# Altium schematic sheet 1541 Interface for ZX-81.SchDoc
size 594 x 420 mm; ApprovedBy: .; CheckedBy: .; Author: DiWou; CompanyName: DL2DW; DrawnBy: DiWou; Engineer: .; Organization: DL2DW; DocumentNumber: 1; Revision: A; SheetNumber: 1; SheetTotal: 1; DrawnDate: 08.10.2020; EngrDate: .; ChkdDate: .; Title1: 1541 Interface for ZX-81; Title2: .; Title3: .; Desc1: Version 1.0; Desc2: .; ApprDate: .
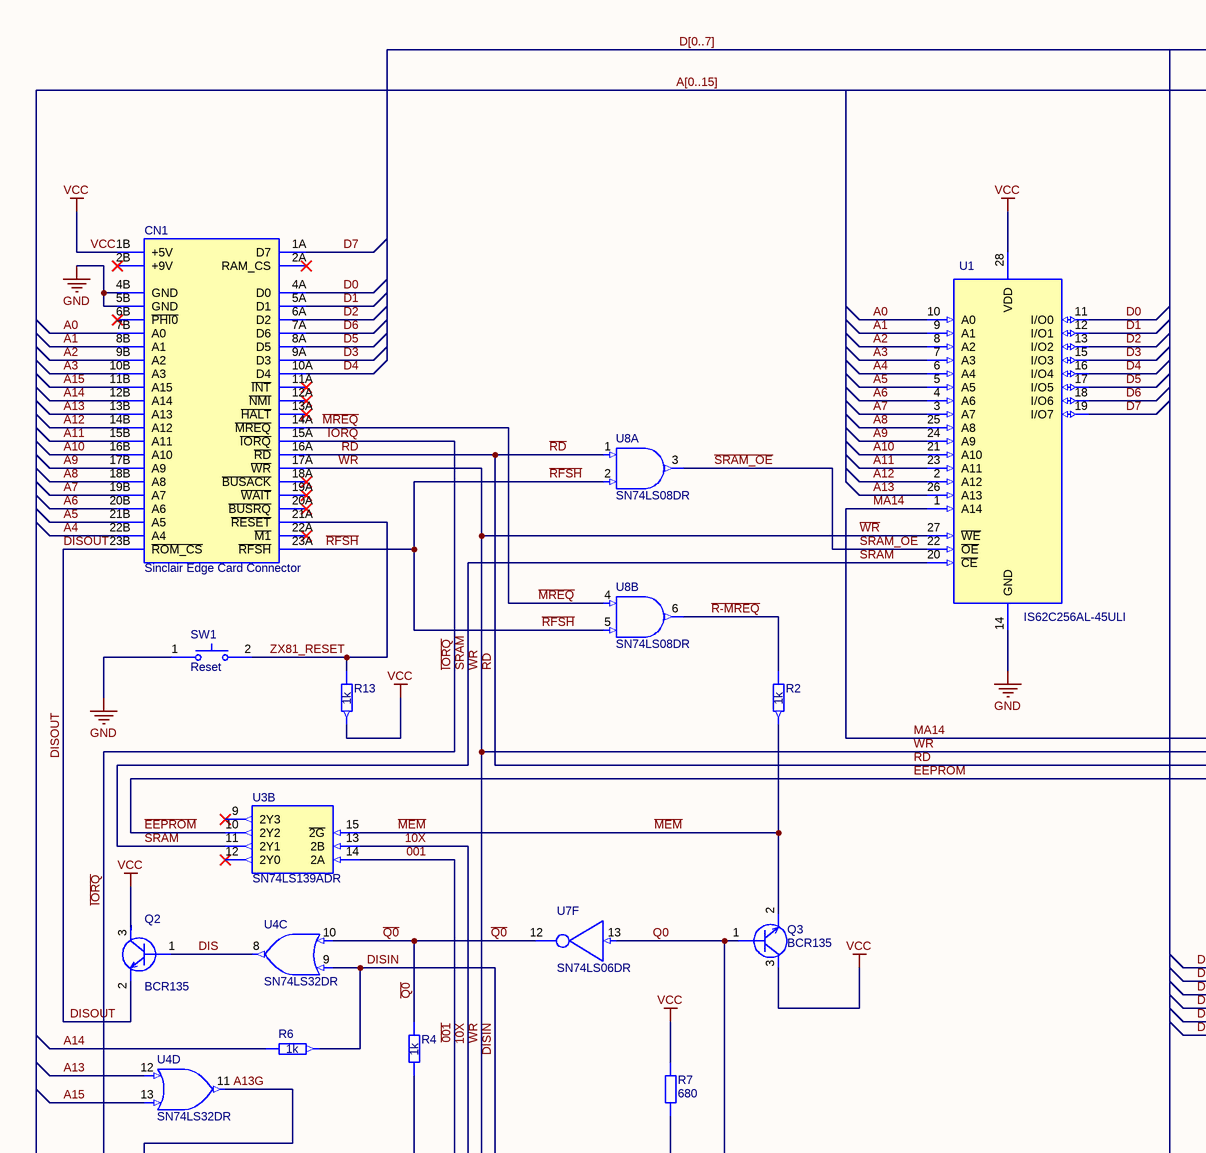
[diagram p0: 1541 Interface for ZX-81.SchDoc, top left]
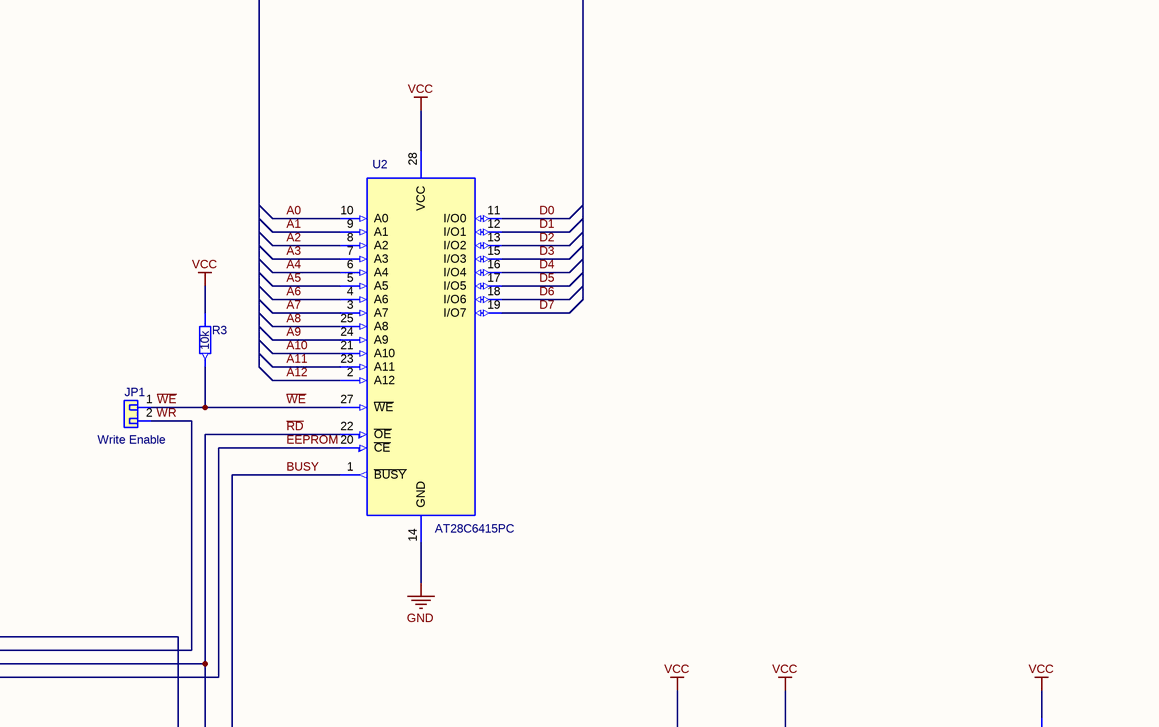
[diagram p1: 1541 Interface for ZX-81.SchDoc, top right]
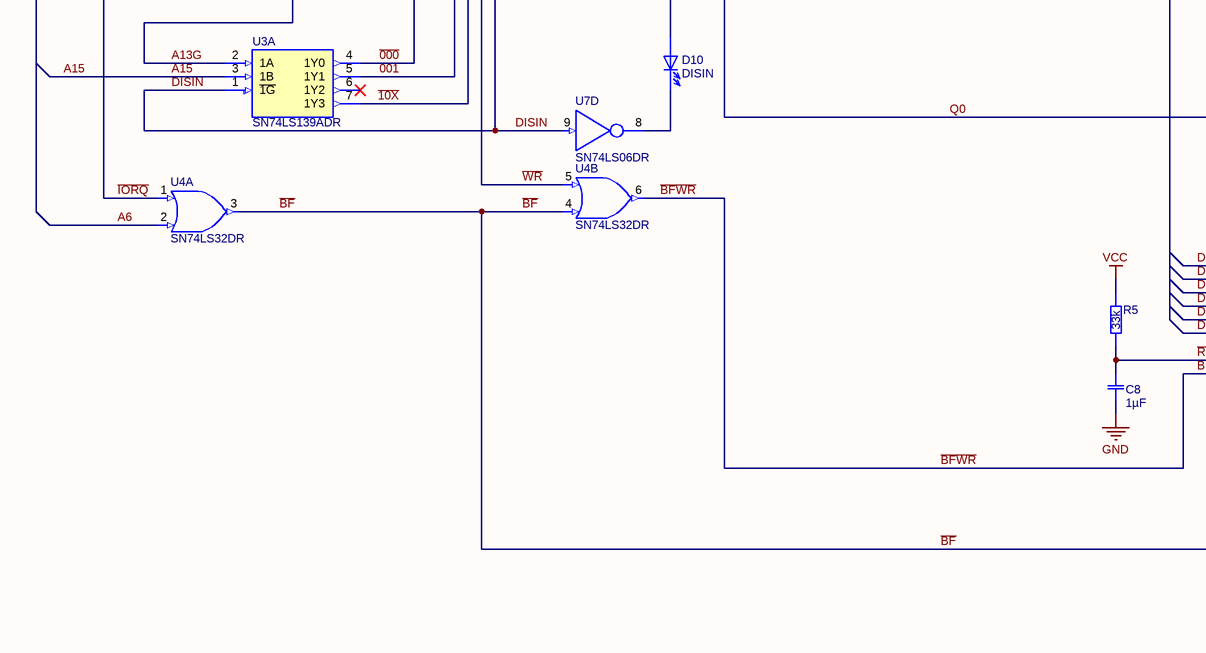
[diagram p2: 1541 Interface for ZX-81.SchDoc, bottom left]
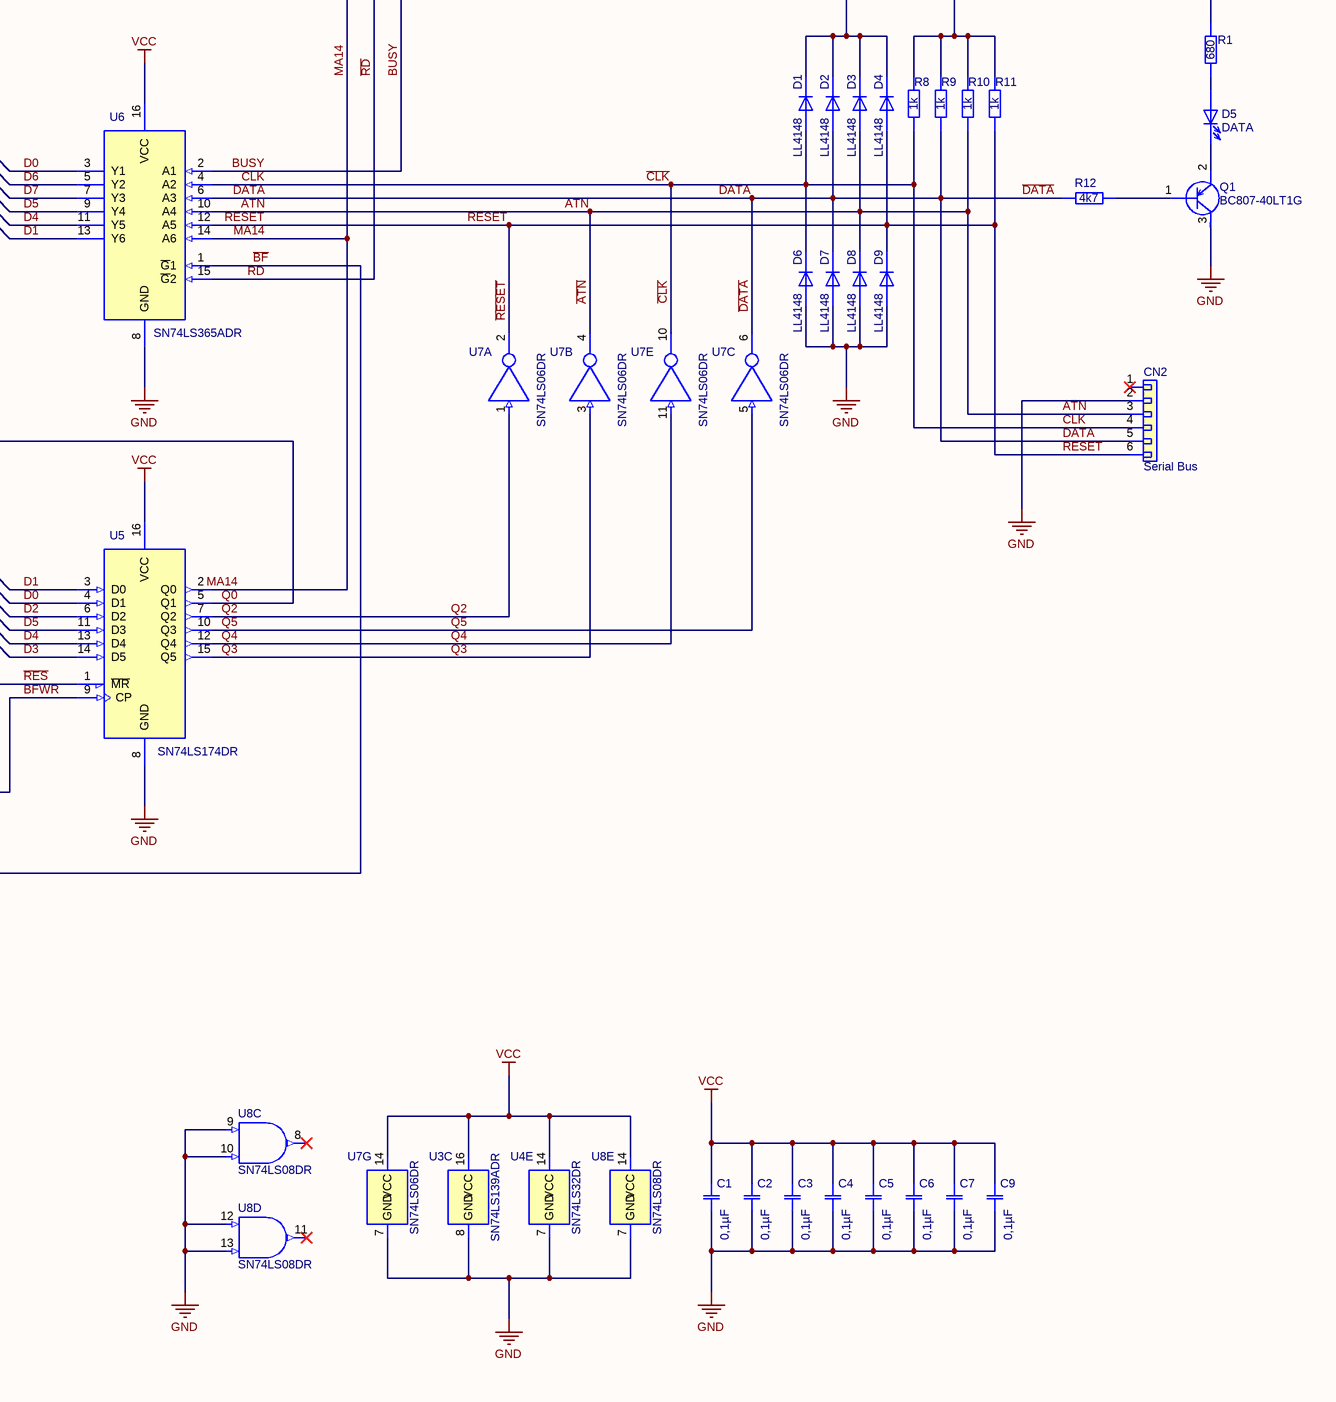
[diagram p3: 1541 Interface for ZX-81.SchDoc, bottom right]

## Parts
C1  0,1µF  [CAP SMD 0.1µF 50V 0805 Kemet C0805C104M5RACTU]
C2  0,1µF  [CAP SMD 0.1µF 50V 0805 Kemet C0805C104M5RACTU]
C3  0,1µF  [CAP SMD 0.1µF 50V 0805 Kemet C0805C104M5RACTU]
C4  0,1µF  [CAP SMD 0.1µF 50V 0805 Kemet C0805C104M5RACTU]
C5  0,1µF  [CAP SMD 0.1µF 50V 0805 Kemet C0805C104M5RACTU]
C6  0,1µF  [CAP SMD 0.1µF 50V 0805 Kemet C0805C104M5RACTU]
C7  0,1µF  [CAP SMD 0.1µF 50V 0805 Kemet C0805C104M5RACTU]
C8  1µF  [CAP 1µF 16V 0805 Kemet C0805C105K4RACTU]
C9  0,1µF  [CAP SMD 0.1µF 50V 0805 Kemet C0805C104M5RACTU]
CN1  Sinclair Edge Card Connector  [Sinclair Card Connector]
CN2  Serial Bus  [Pin Header 01x06 Right Angle RM2.54mm L5.08mm]
D1  LL4148  [MiniMELF Diode]
D2  LL4148  [MiniMELF Diode]
D3  LL4148  [MiniMELF Diode]
D4  LL4148  [MiniMELF Diode]
D5  DATA  [LED 3mm Red Right Angle 4mm]
D6  LL4148  [MiniMELF Diode]
D7  LL4148  [MiniMELF Diode]
D8  LL4148  [MiniMELF Diode]
D9  LL4148  [MiniMELF Diode]
D10  DISIN  [LED 3mm Green Right Angle 4mm]
JP1  Write Enable  [Pin Header 01x02 2.54mm Horizontal Male]
Q1  BC807-40LT1G  [Nexperia BC807-40 SOT23]
Q2  BCR135  [BCR135 SOT23]
Q3  BCR135  [BCR135 SOT23]
R1  680  [680 kOhm R 0805 SMD]
R2  1k  [1,0 kOhm R 0805 SMD]
R3  10k  [10 kOhm R 0805 SMD]
R4  1k  [1,0 kOhm R 0805 SMD]
R5  33k  [33 kOhm R 0805 SMD]
R6  1k  [1,0 kOhm R 0805 SMD]
R7  680  [680 kOhm R 0805 SMD]
R8  1k  [1,0 kOhm R 0805 SMD]
R9  1k  [1,0 kOhm R 0805 SMD]
R10  1k  [1,0 kOhm R 0805 SMD]
R11  1k  [1,0 kOhm R 0805 SMD]
R12  4k7  [4,7 kOhm R 0805 SMD]
R13  1k  [1,0 kOhm R 0805 SMD]
SW1  Reset  [Tactile Switch Push Button Right Angle L=8.35mm]
U1  IS62C256AL-45ULI  [IS62C256AL-45ULI 28L 330mil SOP]
U2  AT28C6415PC  [28C64-150 with Socket]
U3  SN74LS139ADR  [SN74LS139ADR SOIC-15 P1.27mm W3.9mm]  (parts A,B,C of 3)
U4  SN74LS32DR  [SN74LS32DR2 SOIC-14 P1.27mm W3.9mm]  (parts A,B,C,D,E of 5)
U5  SN74LS174DR  [SN74LS174DR SOIC-15 P1.27mm W3.9mm]
U6  SN74LS365ADR  [SN74LS365ADR SOIC-15 P1.27mm W3.9mm]
U7  SN74LS06DR  [SN74LS06DR SOIC-14 P1.27mm W3.9mm]  (parts A,B,C,D,E,F,G of 7)
U8  SN74LS08DR  [SN74LS08DR SOIC-14 P1.27mm W3.9mm]  (parts A,B,C,D,E of 5)

## Nets
GND: C1.1 C2.1 C3.1 C4.1 C5.1 C6.1 C7.1 C8.1 C9.1 CN1.4B(GND) CN1.5B(GND) CN2.2 D6.2 D7.2 D8.2 D9.2 Q1.3 SW1.1 U1.14(GND) U2.14(GND) U3.8(GND) U4.7(GND) U5.8(GND) U6.8(GND) U7.7(GND) U8.7(GND) U8.9(3A) U8.10(3B) U8.12(4A) U8.13(4B)
VCC: C1.2 C2.2 C3.2 C4.2 C5.2 C6.2 C7.2 C9.2 CN1.1B(+5V) D1.1 D2.1 D3.1 D4.1 Q2.3 Q3.3 R1.2 R3.1 R5.2 R7.2 R8.2 R9.2 R10.2 R11.2 R13.2 U1.28(VDD) U2.28(VCC) U3.16(VCC) U4.14(VCC) U5.16(VCC) U6.16(VCC) U7.14(VCC) U8.14(VCC)
~{000}: R4.1 U3.4(1Y0)
~{001}: U3.5(1Y1) U3.14(2A)
~{10X}: U3.7(1Y3) U3.13(2B)
A0: CN1.7B(A0) U1.10(A0) U2.10(A0)
A1: CN1.8B(A1) U1.9(A1) U2.9(A1)
A2: CN1.9B(A2) U1.8(A2) U2.8(A2)
A3: CN1.10B(A3) U1.7(A3) U2.7(A3)
A4: CN1.22B(A4) U1.6(A4) U2.6(A4)
A5: CN1.21B(A5) U1.5(A5) U2.5(A5)
A6: CN1.20B(A6) U1.4(A6) U2.4(A6) U4.2(1B)
A7: CN1.19B(A7) U1.3(A7) U2.3(A7)
A8: CN1.18B(A8) U1.25(A8) U2.25(A8)
A9: CN1.17B(A9) U1.24(A9) U2.24(A9)
A10: CN1.16B(A10) U1.21(A10) U2.21(A10)
A11: CN1.15B(A11) U1.23(A11) U2.23(A11)
A12: CN1.14B(A12) U1.2(A12) U2.2(A12)
A13: CN1.13B(A13) U1.26(A13) U4.12(4A)
A13G: U3.2(1A) U4.11(4Y)
A14: CN1.12B(A14) R6.1
A15: CN1.11B(A15) U3.3(1B) U4.13(4B)
~{ATN}: CN2.3 D3.2 D8.1 R10.1 U6.10(A4) U7.4(2Y)
~{BF}: U4.3(1Y) U4.4(2A) U6.1(~{G}1)
~{BFWR}: U4.6(2Y) U5.9(CP)
BUSY: U2.1(~{BUSY}) U6.2(A1)
~{CLK}: CN2.4 D1.2 D6.1 R8.1 U6.4(A2) U7.10(5Y)
D0: CN1.4A(D0) U1.11(I/O0) U2.11(I/O0) U5.4(D1) U6.3(Y1)
D1: CN1.5A(D1) U1.12(I/O1) U2.12(I/O1) U5.3(D0) U6.13(Y6)
D2: CN1.6A(D2) U1.13(I/O2) U2.13(I/O2) U5.6(D2)
D3: CN1.9A(D3) U1.15(I/O3) U2.15(I/O3) U5.14(D5)
D4: CN1.10A(D4) U1.16(I/O4) U2.16(I/O4) U5.13(D4) U6.11(Y5)
D5: CN1.8A(D5) U1.17(I/O5) U2.17(I/O5) U5.11(D3) U6.9(Y4)
D6: CN1.7A(D6) U1.18(I/O6) U2.18(I/O6) U6.5(Y2)
D7: CN1.1A(D7) U1.19(I/O7) U2.19(I/O7) U6.7(Y3)
~{DATA}: CN2.5 D2.2 D7.1 R9.1 R12.1 U6.6(A3) U7.6(3Y)
DIS: Q2.1 U4.8(3Y)
DISIN: R6.2 U3.1(~{1G}) U4.9(3A) U7.9(4A)
DISOUT: CN1.23B(~{ROM_CS}) Q2.2
~{EEPROM}: U2.20(~{CE}) U3.10(2Y2)
~{IORQ}: CN1.15A(~{IORQ}) U4.1(1A)
~{MEM}: Q3.2 R2.2 U3.15(~{2G})
~{MREQ}: CN1.14A(~{MREQ}) U8.4(2A)
MA14: U1.1(A14) U5.2(Q0) U6.14(A6)
Q0: Q3.1 U5.5(Q1) U7.13(6A)
Q2: U5.7(Q2) U7.1(1A)
Q3: U5.15(Q5) U7.3(2A)
Q4: U5.12(Q4) U7.11(5A)
Q5: U5.10(Q3) U7.5(3A)
~{Q0}: R4.2 U4.10(3B) U7.12(6Y)
~{R-MREQ}: R2.1 U8.6(2Y)
~{RD}: CN1.16A(~{RD}) U2.22(~{OE}) U6.15(~{G}2) U8.1(1A)
~{RES}: C8.2 R5.1 U5.1(~{MR})
~{RESET}: CN2.6 D4.2 D9.1 R11.1 U6.12(A5) U7.2(1Y)
~{RFSH}: CN1.23A(~{RFSH}) U8.2(1B) U8.5(2B)
~{SRAM}: U1.20(~{CE}) U3.11(2Y1)
~{SRAM_OE}: U1.22(~{OE}) U8.3(1Y)
~{WE}: JP1.1 R3.2 U2.27(~{WE})
~{WR}: CN1.17A(~{WR}) JP1.2 U1.27(~{WE}) U4.5(2B)
ZX81_RESET: CN1.21A(~{RESET}) R13.1 SW1.2
NetD5_1: D5.1 Q1.2
NetD5_2: D5.2 R1.1
NetD10_1: D10.1 U7.8(4Y)
NetD10_2: D10.2 R7.1
NetQ1_1: Q1.1 R12.2

Not connected (* = marked no-connect by the designer): CN1 2A(RAM_CS)* 2B(+9V)* 6B(~{PHI0})* 11A(~{INT})* 12A(~{NMI})* 13A(~{HALT})* 18A(~{BUSACK})* 19A(~{WAIT})* 20A(~{BUSRQ})* 22A(~{M1})*; CN2 1*; SW1 3 4; U2 26(N/C); U3 6(1Y2)* 9(2Y3)* 12(2Y0)*; U8 8(3Y)* 11(4Y)*

## Buses and harness runs
bus A[0..15]
bus D[0..7]

## Notes on the sheet
- Drawn by:
- Date
- Size:
- A2
- Rev:
- Engr:
- Chkd:
- Appr:
- File:
- Document No:
- Print Date & Time:
- /
- Sheet
- of

## Library data of the parts
C1-C7 C9 = CMP-Capacitors-Ceramic_Capacitors-00028-1: Capacitor; Ceramic; Cap; .100uF; Tol 20%; SMT; Vol-Rtg 50V; X7R; Tape and Reel; Capacitance: 100nF; Depth: 1.25mm; Packaging: Tape and Reel; Min Operating Temperature: -55°C; Max Operating Temperature: 125°C; Dielectric: X7R; Radiation Hardening: No; Mount: Surface Mount; Case/Package: 0805; Dielectric Material: Ceramic; Height: 0.9mm; Voltage Rating (DC): 50V; Length: 2mm; Tolerance: 20%
C8 = CMP-Capacitors-Ceramic_Capacitors-00042-2: KEMET - C0805C105K4RACTU - SMD Multilayer Ceramic Capacitor, 1 µF, 16 V, 0805 [2012 Metric], ± 10%, X7R, C Series KEMET; Voltage: 16V; Capacitance: 1uF; Dissipation Factor: 5%; Number of Pins: 2; Dielectric: X7R; Width: 0.049inch; Voltage Rating (DC): 16V; Depth: 1.25mm; Dielectric Material: Ceramic; Mount: Surface Mount,PCB; Radiation Hardening: No; Max Operating Temperature: 125°C; Thickness: 0.039inch; Packaging: Tape and Reel; Contact Plating: Tin,Matte; Lead Pitch: 0.75mm; Height: 0.9mm; Termination: SMD/SMT; Case Code (Imperial): 0805; REACH SVHC: No SVHC; Case/Package: 0805; Case Code (Metric): 2012; Voltage Rating: 16V; Length: 2mm; Package Quantity: 1; Tolerance: 10%; Min Operating Temperature: -55°C
CN1 = CMP-Connectors-00027-6
CN2 = CMP-Connectors-Male_PIN_Headers-00025-2: CONN HEADER R/A 6POS 2.54MM; Pitch: 0.1inch; Connector Type: Male Pin; Number of Positions: 6; Color: Black; Termination: Solder; Contact Mating Length: 0.23inch; Contact Plating: Gold; Number of Rows: 1; Packaging: Bulk; Package Quantity: 1; Mount: Through Hole
D1-D4 D6-D9 = CMP-Diodes-00018-2: ON SEMICONDUCTOR - LL4148 - Small Signal Diode, Single, 100 V, 200 mA, 1 V, 4 ns, 2 A; Power Dissipation: 500mW; Max Forward Surge Current (Ifsm): 2A; Forward Voltage: 1V; Forward Current: 200mA; Voltage: 100V; Max Reverse Current: 25nA; Recovery Time: 4ns; Element Configuration: Single; Min Operating Temperature: -65°C; Max Operating Temperature: 175°C; Width: 1.5mm; Radiation Hardening: No; REACH SVHC: No SVHC; Length: 3.6mm; Max Reverse Voltage (DC): 100V; Reverse Voltage: 100V; Mount: Surface Mount; Height: 1.5mm; Contact Plating: Tin,Matte; Packaging: Tape and Reel; Lead Free: Lead Free; Max Surge Current: 2A; Average Rectified Current: 200mA; Weight: 0.01lb; Number of Pins: 2; Peak Non-Repetitive Surge Current: 2A; Max Repetitive Reverse Voltage (Vrrm): 100V; Reverse Recovery Time: 4ns; Package Quantity: 2500
D5 = CMP-LEDs-00000-4: WURTH ELEKTRONIK   151033RS03000   LED, 3MM,  RED, 2600MCD, 621NM; Test Current: 20mA; Lens Style: Clear,Circular,Round; Forward Voltage: 2V; Viewing Angle: 30°; Forward Current: 30mA; Packaging: Bulk; Color: Red; Package Quantity: 1; Mount: Through Hole; Luminous Intensity: 2600mcd; Wavelength: 621nm; Lens Size: 3mm; Dominant Wavelength: 621nm; Case/Package: Radial; Min Operating Temperature: -40°C; REACH SVHC: Unknown; Max Operating Temperature: 85°C; Height: 5.55mm
D10 = CMP-LEDs-00007-1: WURTH ELEKTRONIK - 151033GS03000 - LED, Green, T-1 (3mm), 530 nm, 3.2 V, 30 mA, 15 cd RoHS Compliant: Yes; Forward Voltage: 3.2V; Luminous Intensity: 15000mcd; Lens Style: Clear,Round,Circular; Wavelength: 530nm; Viewing Angle: 30°; Forward Current: 30mA; Test Current: 20mA; Mount: Through Hole; Package Quantity: 1; Case/Package: Radial; Max Operating Temperature: 85°C; Color: Green; REACH SVHC: Unknown; Height: 5.55mm; Lens Size: 3mm; Min Operating Temperature: -40°C; Packaging: Bulk; Dominant Wavelength: 530nm
JP1 = CMP-Connectors-Male_PIN_Headers-00001-4: CONN HEADER .100" SNGL STR 2POS; Pitch: 0.1inch; Connector Type: Male Pin; Number of Positions: 2; Package Quantity: 1; Packaging: Bulk; Mount: Through Hole; Contact Mating Length: 0.318inch; Termination: Solder; Contact Plating: Gold; Color: Black; Number of Rows: 1
Q1 = CMP-Transistors-00011-1: Silicon Transistor Plastic,  BC807-40LT1G; Max Collector Current: 500mA; Power Dissipation: 300mW; Collector Emitter Breakdown Voltage: 45V; Frequency: 100MHz; Emitter Base Voltage (VEBO): 5V; Collector Emitter Saturation Voltage: -700mV; Number of Elements: 1; Collector Base Voltage (VCBO): 50V; Element Configuration: Single; hFE Min: 250; Polarity: PNP; Packaging: Tape and Reel; Case/Package: SOT-23-3; REACH SVHC: No SVHC; Width: 1.3mm; Lead Free: Lead Free; Max Operating Temperature: 150°C; Transition Frequency: 100MHz; Collector Emitter Voltage (VCEO): 45V; Max Frequency: 100MHz; Contact Plating: Tin,Matte; Height: 0.94mm; Min Operating Temperature: -55°C; Number of Pins: 3; Halogen Free: Halogen Free; Radiation Hardening: No; Gain Bandwidth Product: 100MHz; Max Breakdown Voltage: 45V; Max Power Dissipation: 300mW; Package Quantity: 1; Length: 2.9mm
Q2 Q3 = CMP-Transistors-00010-1: BCR135 Series NPN 50 V 100 mA SMT Silicon Digital Transistor - SOT-23-3; Max Collector Current: 100mA; Collector Emitter Saturation Voltage: 300mV; Element Configuration: Single; hFE Min: 70; Power Dissipation: 200mW; Collector Emitter Voltage (VCEO): 50V; Polarity: NPN; Length: 2.9mm; Min Operating Temperature: -65°C; Number of Pins: 3; Width: 1.3mm; Max Operating Temperature: 150°C; Case/Package: SOT; Packaging: Tape and Reel; Height: 1mm
R1 R7 = CMP-Resistors-Yageo_SMD_0805-0140-1: RES SMD 680K OHM 1% 1/8W 0805; Power Rating: 125mW; Temperature Coefficient: 100ppm/°C; Resistance: 680kR; Voltage Rating: 150V; Case Code (Metric): 2012; Case Code (Imperial): 0805; REACH SVHC: Unknown; Packaging: Tape and Reel; Contact Plating: Tin,Matte; Number of Terminations: 2; Composition: Thick Film; Radiation Hardening: No; Military Standard: Not; Length: 0.079inch; Package Quantity: 1; Termination: SMD/SMT; Min Operating Temperature: -55°C; Max Power Dissipation: 125mW; Width: 0.049inch; Features: Moisture Resistant; Tolerance: 1%; Depth: 1.25mm; Max Operating Temperature: 155°C; Lead Free: Lead Free; Height: 0.024inch; Case/Package: 0805
R2 R4 R6 R8-R11 R13 = CMP-Resistors-Yageo_SMD_0805-0072-1: RES SMD 1K OHM 1% 1/8W 0805; Voltage Rating: 150V; Temperature Coefficient: 100ppm/°C; Resistance: 1kR; Max Power Dissipation: 125mW; Height: 0.024inch; Number of Pins: 2; Width: 0.049inch; Min Operating Temperature: -55°C; Termination: SMD/SMT; REACH SVHC: Unknown; Lead Free: Lead Free; Package Quantity: 1; Number of Terminations: 2; Features: Moisture Resistant; Packaging: Tape and Reel; Case Code (Imperial): 0805; Voltage Rating (DC): 150V; Military Standard: Not; Case Code (Metric): 2012; Case/Package: 0805; Tolerance: 1%; Length: 0.079inch; Power Rating: 125mW; Composition: Thick Film; Depth: 1.25mm; Max Operating Temperature: 155°C
R3 = CMP-Resistors-Yageo_SMD_0805-0096-1: RES SMD 10K OHM 1% 1/8W 0805; Temperature Coefficient: 100ppm/°C; Max Power Dissipation: 125mW; Resistance: 10kR; Voltage Rating: 150V; Termination: SMD/SMT; Composition: Thick Film; Tolerance: 1%; Case Code (Imperial): 0805; REACH SVHC: Unknown; Case/Package: 0805; Length: 2mm; Max Operating Temperature: 155°C; Number of Terminations: 2; Case Code (Metric): 2012; Depth: 1.25mm; Height: 0.024inch; Min Operating Temperature: -55°C; Package Quantity: 1; Features: Moisture Resistant; Packaging: Tape and Reel; Power Rating: 125mW; Lead Free: Lead Free; Width: 0.049inch; Military Standard: Not
R5 = CMP-Resistors-Yageo_SMD_0805-0108-1: RES SMD 33K OHM 1% 1/8W 0805; Voltage Rating: 150V; Temperature Coefficient: 100ppm/°C; Power Rating: 125mW; Resistance: 33kR; Number of Terminations: 2; Height: 0.024inch; Case/Package: 0805; Package Quantity: 1; Depth: 1.25mm; Case Code (Metric): 2012; Min Operating Temperature: -55°C; Lead Free: Lead Free; Termination: SMD/SMT; Case Code (Imperial): 0805; Composition: Thick Film; Tolerance: 1%; Max Operating Temperature: 155°C; Features: Moisture Resistant; Packaging: Tape and Reel; Width: 0.049inch; Length: 0.079inch; REACH SVHC: Unknown; Working Voltage: 150V; Max Power Dissipation: 125mW
R12 = CMP-Resistors-Yageo_SMD_0805-0087-1: YAGEO (PHYCOMP)         RC0805FR-074K7L             SMD Chip Resistor, Thick Film, 4.7 kohm, 150 V, 0805 [2012 Metric], 250 mW,  1%; Resistance: 4.7kR; Max Power Dissipation: 125mW; Voltage Rating (DC): 150V; Temperature Coefficient: 100ppm/°C; Width: 0.049inch; Case Code (Imperial): 0805; Packaging: Tape and Reel; Termination: SMD/SMT; Min Operating Temperature: -55°C; Depth: 1.25mm; Length: 0.079inch; Case/Package: 0805; Military Standard: Not; REACH SVHC: No SVHC; Composition: Thick Film; Package Quantity: 5000; Case Code (Metric): 2012; Max Operating Temperature: 155°C; Lead Free: Lead Free; Height: 0.024inch; Number of Terminations: 2; Voltage Rating: 150V; Power Rating: 125mW; Features: Moisture Resistant; Tolerance: 1%; Number of Pins: 2
SW1 = CMP-Switches-00004-1: SWITCH TACTILE SPST-NO 0.05A 24V; Contact Current Rating: 50mA; Mechanical Life: 100000Cycles; Illumination Color: Black; Switch Function: Off-Mom; Operating Force: 160gf; Actuator Material: PBT; Actuator Type: Standard; Throw Configuration: SPST; Actuator Length: 0.226inch; Switch Travel: 0.25mm; Illumination Type: Non-Illuminated; Contact Resistance: 100mR; Min Operating Temperature: -35°C; Type: Switch; Height: 7.3mm; Orientation: Straight; Lead Free: Lead Free; Packaging: Loose Piece; Max Voltage Rating (DC): 24V; Contact Material: Copper Alloy; Contact Plating: Silver; Depth: 12.36mm; Package Quantity: 1000; Max Current Rating: 50mA; Width: 6mm; Radiation Hardening: No; Termination: PC Pins; Max Operating Temperature: 85°C; Length: 7.11mm; Electrical Life: 100000Cycles; Mount: Through Hole; ELV: Compliant
U1 = CMP-ICs-Memory-00012-3: SRAM Chip Async Single 5V 256K-Bit 32K x 8 45ns 28-Pin SOP; Max Supply Voltage: 5.5V; Density: 256Kb; Number of Ports: 1; Memory Type: RAM,SRAM - Asynchronous; Address Bus Width: 15b; Min Supply Voltage: 4.5V; Sync/Async: Asynchronous; Word Size: 8b; Nominal Supply Current: 25mA; Max Frequency: 22MHz; Interface: Parallel; Number of Words: 32000; Case/Package: SOP; Packaging: Rail/Tube; Length: 18.24mm; Package Quantity: 120; Max Operating Temperature: 85°C; Radiation Hardening: No; Height: 2.84mm; Operating Supply Voltage: 5V; Voltage: 5V; Access Time: 45ns; Lead Free: Lead Free; Number of Pins: 28; Min Operating Temperature: -40°C; REACH SVHC: No SVHC; Width: 8.53mm; Memory Size: 256Kb
U2 = CMP-ICs-Memory-00010-2: IC EEPROM 64KBIT 150NS 28DIP; Memory Size: 64Kb; Frequency: 150GHz; Min Supply Voltage: 4.5V; Max Supply Voltage: 5.5V; Nominal Supply Current: 30mA; Interface: Parallel; Number of Pins: 28; Lead Free: Contains Lead; Min Operating Temperature: 0°C; Access Time: 150ns; Memory Type: EEPROM; Case/Package: PDIP; Density: 64Kb; Max Operating Temperature: 70°C; Packaging: Rail/Tube; Mount: Through Hole; Package Quantity: 14
U3 = CMP-ICs-74xx-series-00066-1: Decoder/Demultiplexer Dual 2-to-4 16-Pin SOIC T/R; Propagation Delay: 33ns; Turn-On Delay Time: 38ns; Low Level Output Current: 8mA; Number of Inputs: 2; Bandwidth: 35MHz; High Level Output Current: -400uA; Min Supply Voltage: 4.75V; Number of Output Lines: 4; Supply Type: Single; Logic Function: Demultiplexer,Decoder; Max Supply Voltage: 5.25V; Operating Supply Voltage: 5V; Polarity: Inverting; Max Operating Temperature: 70°C; Package Quantity: 2500; Radiation Hardening: No; Min Operating Temperature: 0°C; Packaging: Tape and Reel; Weight: 0.004998oz; Number of Channels: 2; Lead Free: Lead Free; Number of Elements: 2; Independent Circuits: 2; Mount: Surface Mount; Number of Outputs: 4; Number of Pins: 16; Number of Bits: 4; Case/Package: SOIC; Number of Input Lines: 2
U4 = CMP-ICs-74xx-series-00065-1: IC GATE OR 4CH 2-INP 14SOIC; Operating Supply Voltage: 5V; High Level Output Current: -16mA; Turn-On Delay Time: 22ns; Number of Elements: 4; Low Level Output Current: 800uA; Number of Output Lines: 1; Number of Inputs: 2; Quiescent Current: 4.9mA; Max Supply Voltage: 5.25V; Output Type: TTL; Logic Function: OR GATE; Output Current: 8mA; Min Supply Voltage: 4.75V; Packaging: Tape and Reel; Radiation Hardening: No; Max Operating Temperature: 70°C; Mount: Surface Mount; Case/Package: SOIC; Number of Bits: 4; REACH SVHC: No SVHC; Lead Free: Lead Free; Number of Pins: 14; Number of Gates: 4; Package Quantity: 2500; Number of Outputs: 1; Propagation Delay: 22ns; Weight: 0.004564oz; Number of Input Lines: 2; Min Operating Temperature: 0°C; Number of Circuits: 4
U5 = CMP-ICs-74xx-series-00067-1: Flip Flops Hex; Number of Output Lines: 2; Output Type: TTL; Frequency: 40MHz; Min Supply Voltage: 4.75V; Number of Bits per Element: 6; Number of Elements: 1; Propagation Delay: 30ns; Polarity: Non-Inverting; High Level Output Current: -400uA; Output Current: 8mA; Operating Supply Voltage: 5V; Turn-On Delay Time: 35ns; Logic Function: D-Type,Flip-Flop; Clock Edge Trigger Type: Positive Edge; Max Supply Voltage: 5.25V; Number of Circuits: 7; Number of Pins: 16; Package Quantity: 2500; Weight: 0.004998oz; Radiation Hardening: No; Number of Bits: 6; Min Operating Temperature: 0°C; Mount: Surface Mount; Case/Package: SOIC; Max Operating Temperature: 70°C; Number of Input Lines: 2; Low Level Output Current: 8mA; Packaging: Tape and Reel; Lead Free: Lead Free
U6 = CMP-ICs-74xx-series-00068-1: IC BUFF/DVR TRI-ST 6BIT 16SOIC; Propagation Delay: 22ns; High Level Output Current: -2.6mA; Max Supply Voltage: 5.25V; Number of Elements: 1; Number of Output Lines: 6; Logic Function: Buffer,Inverting; Min Supply Voltage: 4.75V; Operating Supply Voltage: 5V; Low Level Output Current: 24mA; Polarity: Non-Inverting; Radiation Hardening: No; Mount: Surface Mount; Case/Package: SOIC; Number of Outputs: 6; Packaging: Tape and Reel; Lead Free: Lead Free; Contact Plating: Gold; Max Operating Temperature: 70°C; Number of Bits: 6; Number of Bits per Element: 6; Min Operating Temperature: 0°C; Number of Input Lines: 6; Number of Pins: 16; Package Quantity: 2500
U7 = CMP-ICs-74xx-series-00051-2: IC INVERTER OPEN COL 6CH 14SOIC; Propagation Delay: 20ns; High Level Output Current: -250uA; Logic Function: Buffer,Inverter; Polarity: Inverting; Max Supply Voltage: 5.25V; Number of Inputs: 6; Operating Supply Voltage: 5V; Min Supply Voltage: 4.75V; Low Level Output Current: 40mA; Lead Free: Lead Free; Radiation Hardening: No; Package Quantity: 1; Max Operating Temperature: 70°C; REACH SVHC: No SVHC; Turn-On Delay Time: 20ns; Mount: Surface Mount; Number of Pins: 14; Number of Elements: 6; Packaging: Tape and Reel; Number of Outputs: 6; Number of Bits: 6; Number of Input Lines: 6; Min Operating Temperature: 0°C; Number of Channels: 6; Case/Package: SOIC; Number of Gates: 6; Contact Plating: Gold; Number of Circuits: 6; Number of Output Lines: 6
U8 = CMP-ICs-74xx-series-00069-1: TEXAS INSTRUMENTS         SN74LS08DR             AND Gate, 8 Input, 4 Gate, 8 mA, 4.75V to 5.25V, SOIC-14; Number of Outputs: 1; Operating Supply Voltage: 5V; Number of Gates: 4; Quiescent Current: 4.4mA; High Level Output Current: -800uA; Turn-On Delay Time: 25ns; Number of Input Lines: 2; Output Current: 8mA; Low Level Output Current: 16mA; Propagation Delay: 20ns; Mount: Surface Mount; Contact Plating: Gold; Number of Output Lines: 1; Packaging: Tape and Reel; Case/Package: SOIC; Number of Elements: 4; Max Operating Temperature: 70°C; Max Supply Voltage: 5.25V; Number of Inputs: 2; Min Operating Temperature: 0°C; REACH SVHC: No SVHC; Min Supply Voltage: 4.75V; Number of Bits: 4; Radiation Hardening: No; Number of Circuits: 4; Package Quantity: 2500; Lead Free: Lead Free; Number of Pins: 14; Logic Function: AND GATE; Weight: 0.004564oz